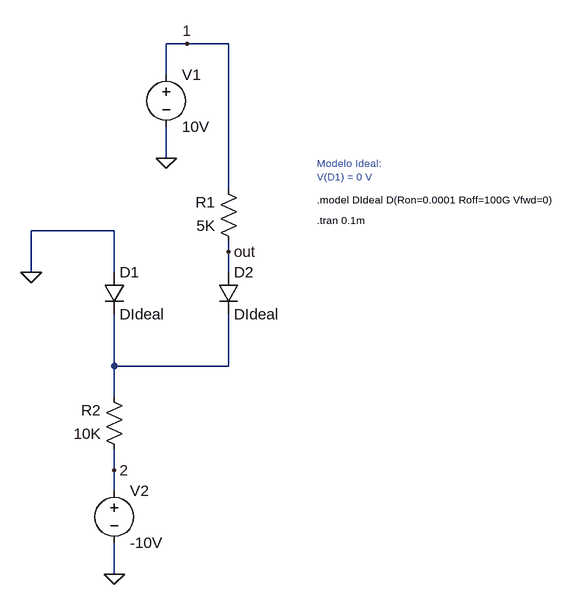
[diagram p0: schematic circuito2_ideal.asc]
circuito2_ideal.asc, the LTspice schematic file:
Version 4
SHEET 1 1376 756
WIRE 336 -80 304 -80
WIRE 400 -80 336 -80
WIRE 304 -32 304 -80
WIRE 304 96 304 48
WIRE 400 144 400 -80
WIRE 224 208 96 208
WIRE 400 240 400 224
WIRE 96 272 96 208
WIRE 224 272 224 208
WIRE 400 272 400 240
WIRE 224 416 224 336
WIRE 400 416 400 336
WIRE 400 416 224 416
WIRE 224 464 224 416
WIRE 224 576 224 544
WIRE 224 608 224 576
WIRE 224 736 224 688
FLAG 96 272 0
FLAG 304 96 0
FLAG 224 736 0
FLAG 336 -80 1
FLAG 224 576 2
FLAG 400 240 out
SYMBOL diode 208 272 R0
SYMATTR InstName D1
SYMATTR Value DIdeal
SYMBOL res 416 240 R180
WINDOW 0 36 76 Left 2
WINDOW 3 36 40 Left 2
SYMATTR InstName R1
SYMATTR Value 5K
SYMBOL diode 384 272 R0
SYMATTR InstName D2
SYMATTR Value DIdeal
SYMBOL voltage 224 592 R0
SYMATTR InstName V2
SYMATTR Value -10V
SYMBOL voltage 304 -48 R0
WINDOW 123 0 0 Left 0
WINDOW 39 0 0 Left 0
SYMATTR InstName V1
SYMATTR Value 10V
SYMBOL res 240 560 R180
WINDOW 0 36 76 Left 2
WINDOW 3 36 40 Left 2
SYMATTR InstName R2
SYMATTR Value 10K
TEXT 536 192 Left 1 !.tran 0.1m
TEXT 536 160 Left 1 !.model DIdeal D(Ron=0.0001 Roff=100G Vfwd=0)
TEXT 536 104 Left 1 ;Modelo Ideal:\nV(D1) = 0 V

The netlist it stands for:
* circuito2_ideal.asc
D1 0 N001 DIdeal
R1 out 1 5K
D2 out N001 DIdeal
V2 2 0 -10V
V1 1 0 10V
R2 2 N001 10K
.model D D
.lib standard.dio
.tran 0.1m
.model DIdeal D(Ron=0.0001 Roff=100G Vfwd=0)
* Modelo Ideal:
* V(D1) = 0 V
.backanno
.end